# EAGLE design WeMos-Matrix-Shield (EAGLE 7.7.0)
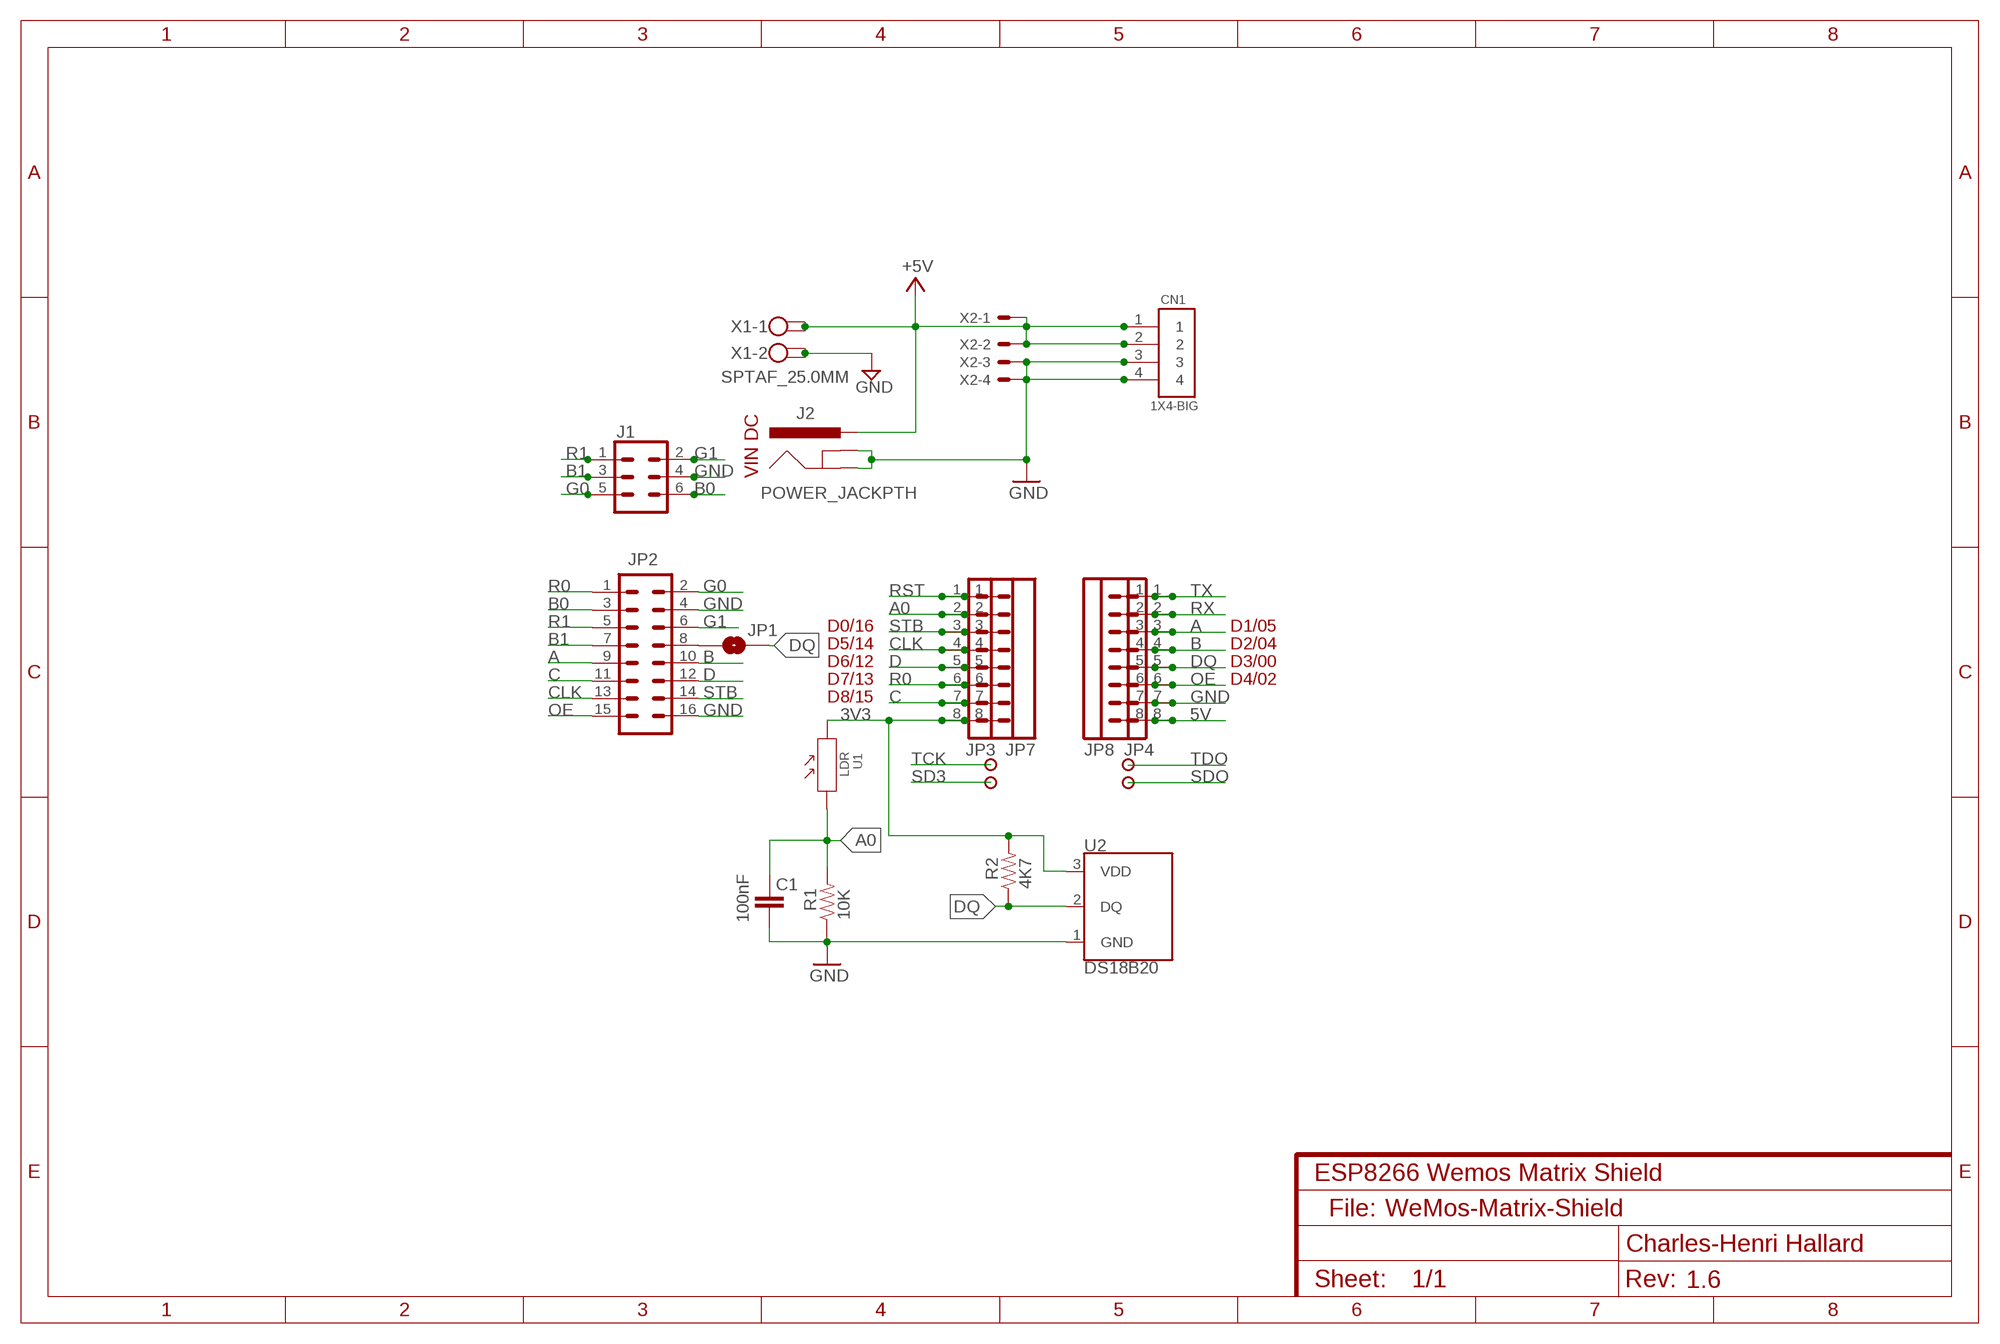
[diagram p0: schematic, sheet 1]
NAME (FRAME-A4L): CNAME: ESP8266 Wemos Matrix Shield; CREVISION: 1.6; DESIGNER: Charles-Henri Hallard

## Parts
C1  100nF  CAPPTH2  [CAP-PTH-SMALL2]
CN1  1X4-BIG  [1X04-BIG]
J1  CONN_03X22X3_SILK_MALE_PTH  [2X3]
J2  POWER_JACKPTH  [POWER_JACK_PTH]
JP1  JUMPER-SMT_2_NO_NO-SILK  [SMT-JUMPER_2_NO_NO-SILK]
JP2  M08X2  [2X8]
JP3  M08NO_SILK_FEMALE_PTH  [1X08_NO_SILK]
JP4  M08NO_SILK_FEMALE_PTH  [1X08_NO_SILK]
JP7  M08NO_SILK_FEMALE_PTH  [1X08_NO_SILK]
JP8  M08NO_SILK_FEMALE_PTH  [1X08_NO_SILK]
R1  10K  RESISTORPTH-1/6W  [1/6W-RES]
R2  4K7  RESISTORPTH-1/6W  [1/6W-RES]
U1  LDR  PHOTORESISTOR-5528-10K(2P-5.0X4.2MM)  [SNR2-3.0]
U2  DS18B20  [TO-92-AMMO]
VIN1  PADNORMAL  [PAD]
VIN2  PADNORMAL  [PAD]
VIN3  PADNORMAL  [PAD]
VIN4  PADNORMAL  [PAD]
X1  SPTAF_25.0MM  [SPTAF_2X50]
X2  KK-156-4  [KK-156-4]

## Nets
3V3: JP3.8 JP7.8 R2.2 U1.2 U2.3(VDD)
5V: CN1.1 CN1.2 J2.PWR JP4.8 JP8.8 X1.1 X1.1A X2.1 X2.2 ; supply symbol labelled +5V
A: JP2.9 JP4.3 JP8.3
A0: C1.1 JP3.2 JP7.2 R1.2 U1.1
B: JP2.10 JP4.4 JP8.4
B0: J1.6 JP2.3
B1: J1.3 JP2.7
C: JP2.11 JP3.7 JP7.7
CLK: JP2.13 JP3.4 JP7.4
D: JP2.12 JP3.5 JP7.5
DQ: JP1.2 JP4.5 JP8.5 R2.1 U2.2(DQ)
G0: J1.5 JP2.2
G1: J1.2 JP2.6
GND: C1.2 CN1.3 CN1.4 J1.4 J2.GND J2.GNDBREAK JP2.4 JP2.16 JP4.7 JP8.7 R1.1 U2.1(GND) X1.2 X1.2A X2.3 X2.4
N$1: JP1.1 JP2.8
OE: JP2.15 JP4.6 JP8.6
R0: JP2.1 JP3.6 JP7.6
R1: J1.1 JP2.5
RST: JP3.1 JP7.1
RX: JP4.2 JP8.2
SD3: VIN4.1
SDO: VIN2.1
STB: JP2.14 JP3.3 JP7.3
TCK: VIN3.1
TDO: VIN1.1
TX: JP4.1 JP8.1

## Notes on the sheet
- VIN DC
- D0/16 | D1/05
- D5/14 | D2/04
- D6/12 | D3/00
- D7/13 | D4/02
- D8/15
- File:

## Library data of the parts
C1 = _c2h:CAP: Capacitor Standard 0603 ceramic capacitor, and 0.1" leaded capacitor.
CN1 = adafruit:1X4: 4-pin connector
J1 = SparkFun-Connectors:CONN_03X2: Multi connection point. Often used as Generic Header-pin footprint for 0.1 inch spaced/style header connections You can populate with any combo of single row headers, but if you'd like an exact match, check these: Header - 2x3 (Male, 0.1") <https://www.sparkfun.com/products/12807> (PRT-12807) Header - 2x3 (Female, 0.1") <https://www.sparkfun.com/products/13010> (PRT-13010) 2x3 Pin Shrouded Header <https://www.sparkfun.com/products/10877> (PRT-10877) On any of the 0.1 inch spaced packages, you can populate with these: Break Away Headers - Straight <https://www.sparkfun.com/products/116> (PRT-00116) Break Away Male Headers - Right Angle <https://www.sparkfun.com/products/553> (PRT-00553) Female Headers <https://www.sparkfun.com/products/115> (PRT-00115) Break Away Headers - Machine Pin <https://www.sparkfun.com/products/117> (PRT-00117) Break Away Female Headers - Swiss Machine Pin <https://www.sparkfun.com/products/743> (PRT-00743) Special note: the shrouded connector mates well with our 3x2 ribbon cables: Ribbon Crimp Connector - 6-pin (2x3, Female) <https://www.sparkfun.com/products/10651> (PRT-10651) Ribbon Cable - 6 wire (15ft) <https://www.sparkfun.com/products/10646> (PRT-10646); PROD_ID: CONN-09701
J2 = SparkFun-Connectors:POWER_JACK: Power Jack This is the standard 5.5mm barrel jack for power. The PTH is the most common, proven, reliable, footprint. The Slot footprint only works if the mill layer is transmitted to the PCB fab house so be warned. Spark Fun Electronics SKU : PRT-00119 SMT: CONN-08106 Mating wall wart : TOL-00298 (and others)
JP1 = SparkFun-Jumpers:JUMPER-SMT_2_NO: Normally open jumper This jumper has two pads in close proximity to each other. Apply solder to close the connection. Round pads are easier to solder for beginners, but are a lot larger. SparkFun Product that uses the round pads: SparkFun EL Sequencer <https://www.sparkfun.com/products/12781>
JP2 = PatternAgents-ProtoPads:M08X2: .1" headers, two rows of 8 each
JP3 JP4 JP7 JP8 = SparkFun-Connectors:M08: Header 8 Standard 8-pin 0.1" header. Use with straight break away headers (SKU : PRT-00116), right angle break away headers (PRT-00553), swiss pins (PRT-00743), machine pins (PRT-00117), and female headers (PRT-00115).; PROD_ID: CONN-08438
R1 R2 = _c2h:RESISTOR: Resistor Basic schematic elements and footprints for 0603, 1206, and PTH resistors.
U1 = Seeed-Sensor:PHOTORESISTOR-5528-10K(2P-5.0X4.2MM): 314020017; MPN: PHOTORESISTOR-5528-10K; VALUE: PHOTORESISTOR-5528-10K
U2 = SparkFun-Sensors:DS18B20: Dallas/Maxim DS18B20 1-Wire Temperature Sensor The DS18B20 reports degrees C with 9 to 12-bit precision, -55C to 125C (+/-0.5C). Each sensor has a unique 64-Bit Serial number etched into it - allows for a huge number of sensors to be used on one data bus. Datasheet <http://datasheets.maximintegrated.com/en/ds/DS18B20.pdf> SparkFun Products One Wire Digital Temperature Sensor - DS18B20 <https://www.sparkfun.com/products/245> (SEN-00245); STORE_ID: SEN-00245
VIN1-VIN4 = _c2h:PAD
X1 = _c2h:SPTAF_2: PHOENIX
X2 = con-molex:KK-156-4: KK 156 HEADER Source: http://www.molex.com/pdm_docs/sd/026604100_sd.pdf; OC_FARNELL: unknown; OC_NEWARK: unknown

## Net classes
0 default: width 0.203 mm, drill 0.356 mm, clearance 0.152 mm
1 power: width 0.203 mm, clearance 0.152 mm

## Board
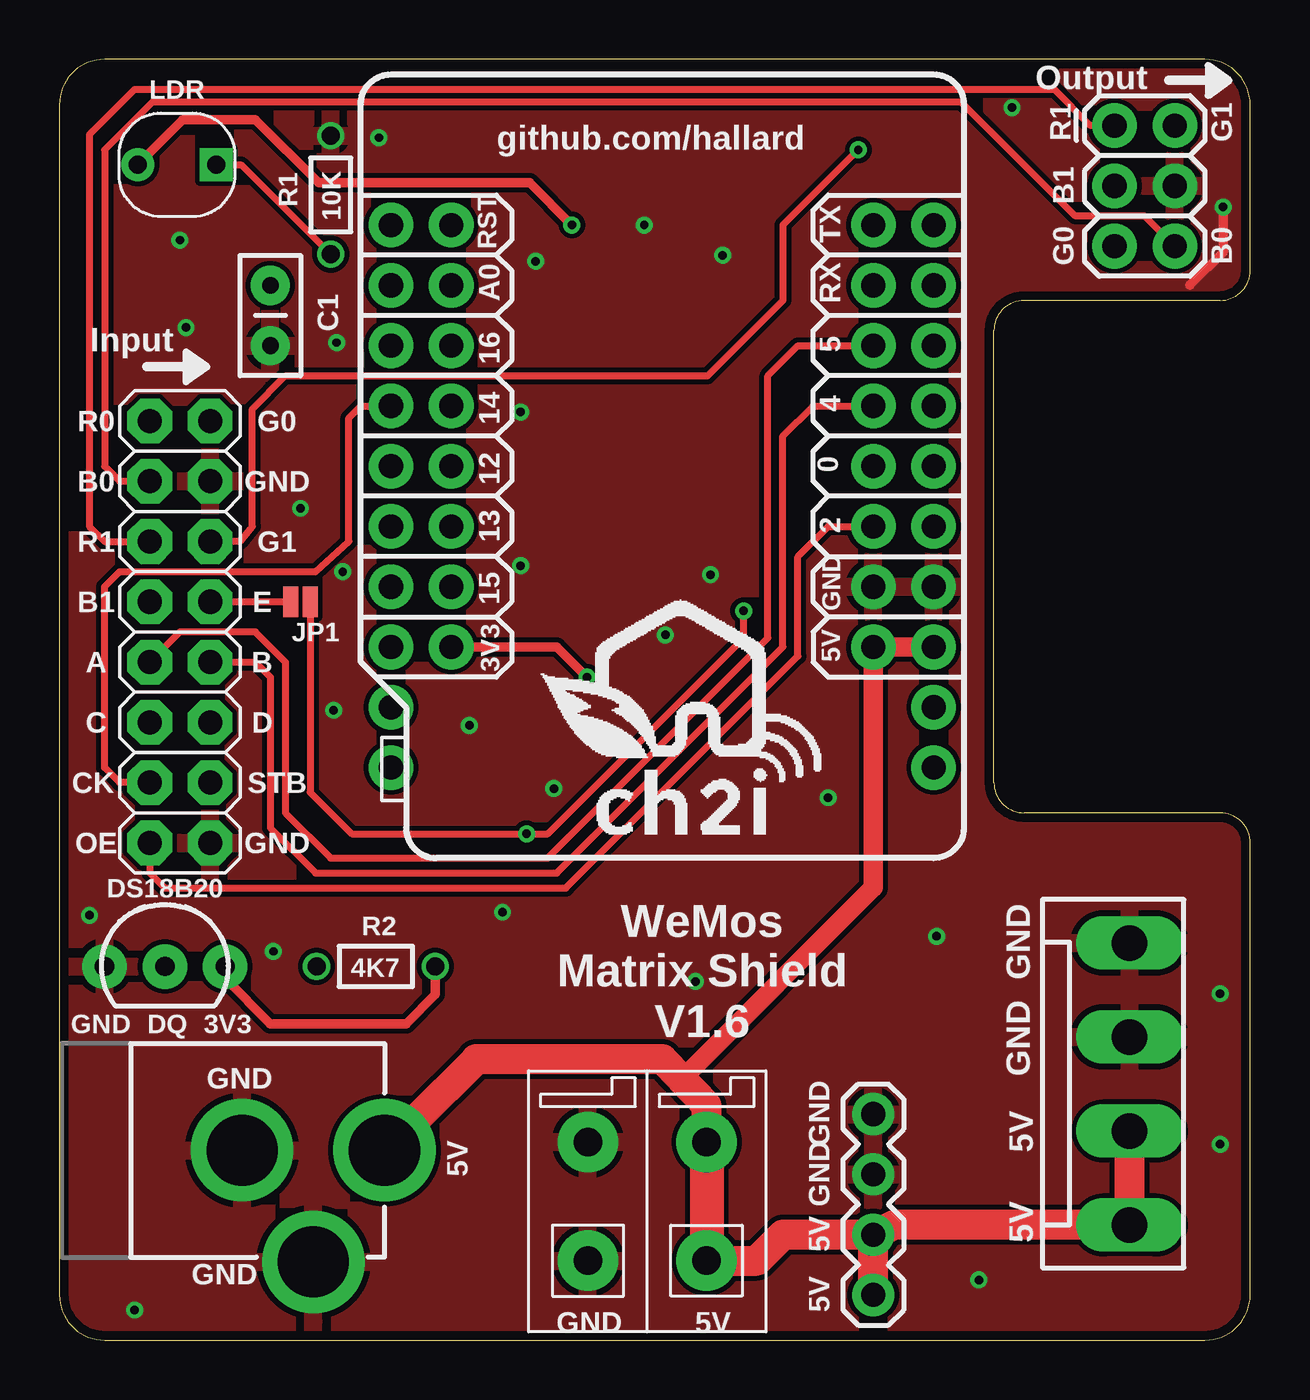
[diagram p1: board, top side]
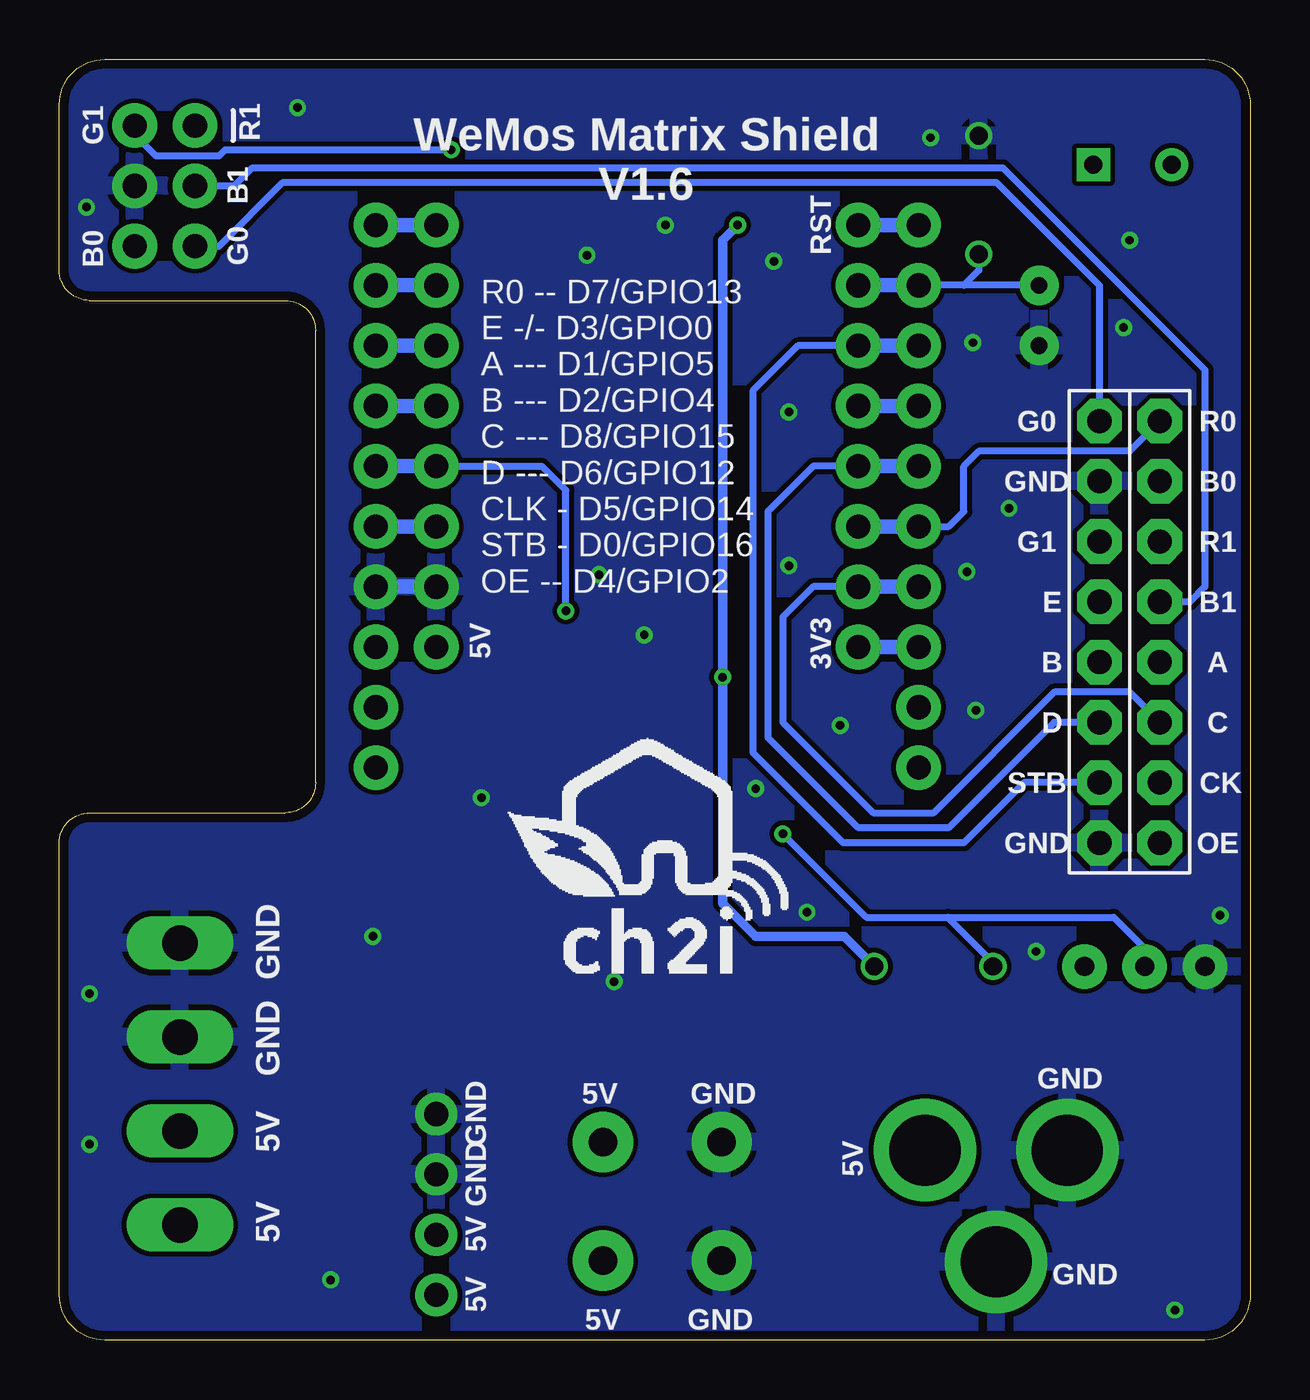
[diagram p2: board, bottom side, seen from below]

Size 50.16 x 53.98 mm. Coordinates in mm from the lower left corner, seen from the top.
Outline: 1.91,53.98 arc90 0,52.07 0,1.91 arc90 1.91,0 48.26,0 arc90 50.16,1.91 50.16,20.95 arc90 48.9,22.23 40.64,22.23 arc-90 39.37,23.5 39.37,42.55 arc-90 40.64,43.81 48.9,43.81 arc90 50.16,45.09 50.16,52.07 arc90 48.26,53.98 1.91,53.98
Copper layers (1*16): Top 0.0356mm / dielectric 1.5011mm / Bottom 0.0356mm
Design rules "PCBs_io *": minimum track width 6mil, minimum drill 13mil, track to track 6mil, track to pad 6mil, pad to pad 6mil, via to via 6mil, smd to smd 6mil, copper to edge 15mil, drill to drill 6mil, minimum pad ring 7mil, minimum via ring 7mil, stop-mask expansion 3mil, vias tented up to drill 40mil, thermal gap 10mil

### Footprints (pad centres in the part's own frame; a part is rotated, then mirrored left to right if it is on the bottom)
CAP-PTH-SMALL2 = drill 0.7 pad 1.651: 1 0,0; 2 2.54,0
1X04-BIG = drill 1.016 pad 1.778: 1 0,0; 2 2.54,0; 3 5.08,0; 4 7.62,0
2X3 = drill 1.016 pad 1.88: 1 0,0; 2 0,2.54; 3 2.54,0; 4 2.54,2.54; 5 5.08,0; 6 5.08,2.54
POWER_JACK_PTH = drill 2.997 pad 4.318: GND 0,7.7; GNDBREAK 4.7,10.7; PWR 0,13.7
SMT-JUMPER_2_NO_NO-SILK = smd 0.635 x 1.27: 1 -0.406,0; 2 0.406,0
2X8 = drill 1.016 pad 1.88 octagon: 1 0,0; 2 0,2.54; 3 2.54,0; 4 2.54,2.54; 5 5.08,0; 6 5.08,2.54; 7 7.62,0; 8 7.62,2.54; 9 10.16,0; 10 10.16,2.54; 11 12.7,0; 12 12.7,2.54; 13 15.24,0; 14 15.24,2.54; 15 17.78,0; 16 17.78,2.54
1X08_NO_SILK = drill 1.016 pad 1.88: 1 0,0; 2 2.54,0; 3 5.08,0; 4 7.62,0; 5 10.16,0; 6 12.7,0; 7 15.24,0; 8 17.78,0
1/6W-RES = drill 0.762: 1 -2.5,0; 2 2.5,0
SNR2-3.0 = drill 0.762 pad 1.397 square: 1 -1.651,0 | drill 0.762 pad 1.397: 2 1.651,0
TO-92-AMMO = drill 0.813 pad 1.88: 1 -2.54,0; 2 0,0; 3 2.54,0
PAD = drill 1.016 pad 1.88: 1 0,0
SPTAF_2X50 = drill 1.2 pad 2.54: 1 -2.5,-2; 1A -2.5,3; 2 2.5,-2; 2A 2.5,3
KK-156-4 = drill 1.5 pad 1.93 long: 1 -5.94,0; 2 -1.98,0; 3 1.98,0; 4 5.94,0

### Placement (x,y rotation side)
C1  8.89,44.45 270 top
CN1  34.29,1.91 90 top
J1  44.45,51.18 270 top
J2  0,8 270 top
JP1  10.16,31.11 0 top
JP2  3.81,38.73 270 top
JP3  13.97,46.99 270 bottom
JP4  36.83,46.99 270 bottom
JP7  16.51,46.99 270 bottom
JP8  34.29,46.99 270 bottom
R1  11.43,48.26 270 top
R2  13.33,15.75 0 top
U1  4.95,49.53 180 top
U2  4.45,15.75 0 top
U$1  [LOGO_CH2I_110MM]  24.77,18.41 0 bottom
U$3  [LOGO_CH2I_110MM]  26.8,24.26 0 top
VIN1  36.83,26.67 0 top
VIN2  36.83,24.13 0 top
VIN3  13.97,26.67 0 top
VIN4  13.97,24.13 0 top
X1  24.77,6.35 180 top
X2  45.09,10.79 90 top

### Tracks (layer width: path | path; a pad name or v marks a point on that pad's centre or on a via)
3V3  (via drill 0.36 pad 0.71)
  Top 0.406: v21.59,46.99 19.81,48.77 10.92,48.77 8.26,51.44 5.21,51.44 U1.2 | U2.3 6.98,15.24 8.89,13.34 14.6,13.34 15.83,14.56 R2.2 | JP7.8 20.95,29.21 v22.23,27.94
  Bottom 0.406: v21.59,46.99 22.23,46.35 v22.23,27.94 22.23,18.41 20.83,17.02 17.1,17.02 R2.2
  Bottom 0.61: JP7.8 JP3.8
5V
  Top 0.813: JP4.8 JP8.8 34.29,19.07 26.21,10.99
  Top 1.016: X1.1A 27.13,3.35
  Top 1.27: J2.PWR 14.97,9.26 17.55,11.84 25.4,11.84 26.21,10.99 27.27,9.89 X1.1 | X2.2 X2.1 35.15,4.86 CN1.2 | CN1.1 CN1.2 | CN1.2 30.48,4.45 29.39,3.35 X1.1A
  Top 1.422: 27.3,8.39 X1.1 X1.1A
A
  Top 0.305: JP8.3 31.12,41.91 29.84,40.64 29.84,29.59 20.57,20.32 11.43,20.32 9.53,22.23 9.53,28.57 8.26,29.84 5.08,29.84 JP2.9
  Bottom 0.61: JP8.3 JP4.3
A0
  Top 0.305: U1.1 7.66,49.53 R1.2
  Bottom 0.305: C1.1 12.06,44.45 | 12.06,44.45 JP3.2 | R1.2 11.43,45.09 12.06,44.45
  Bottom 0.61: JP7.2 JP3.2
B
  Top 0.305: JP8.4 31.75,39.37 30.48,38.1 30.48,29.21 20.95,19.68 10.79,19.68 8.89,21.59 8.89,27.94 8.26,28.57 JP2.10
  Bottom 0.61: JP4.4 JP8.4
B0
  Top 0.305: JP2.3 2.54,36.2 1.91,36.83 1.91,50.16 3.94,52.2 37.97,52.2 42.8,47.37 45.72,47.37 J1.6
B1
  Bottom 0.305: JP2.7 2.54,31.11 1.91,31.75 1.91,40.89 10.41,49.4 42.04,49.4 42.8,48.64 J1.3
C
  Bottom 0.305: JP3.7 18.41,31.75 19.69,30.48 19.69,26.04 15.87,22.23 13.33,22.23 8.26,27.3 5.08,27.3 JP2.11
  Bottom 0.61: JP7.7 JP3.7
CLK
  Top 0.305: JP3.4 12.7,39.37 12.19,38.86 12.19,33.66 10.79,32.38 2.54,32.38 1.91,31.75 1.91,24.13 2.54,23.5 JP2.13
  Bottom 0.61: JP7.4 JP3.4
D
  Bottom 0.305: JP3.5 18.41,36.83 20.32,34.92 20.32,25.4 16.51,21.59 12.7,21.59 8.26,26.04 JP2.12
  Bottom 0.61: JP7.5 JP3.5
DQ  (via drill 0.36 pad 0.71)
  Top 0.305: v28.83,30.73 28.83,29.59 20.57,21.34 v19.69,21.34 12.32,21.34 10.57,23.09 JP1.2
  Bottom 0.305: v28.83,30.73 28.83,35.81 29.84,36.83 JP8.5 | v19.69,21.34 16.17,17.82 12.74,17.82 | 12.74,17.82 10.83,15.91 R2.1 | U2.2 4.45,16.51 5.76,17.82 12.74,17.82
  Bottom 0.61: JP4.5 JP8.5
G0
  Bottom 0.305: JP2.2 6.35,44.45 10.67,48.77 40.77,48.77 43.43,46.1 J1.5
G1  (via drill 0.36 pad 0.71)
  Top 0.305: JP2.6 7.62,33.66 8.13,34.29 8.13,39.24 9.53,40.64 27.3,40.64 30.48,43.81 30.48,46.99 v33.66,50.16
  Bottom 0.305: J1.2 46.99,50.8 46.1,49.91 43.43,49.91 43.18,50.16 v33.66,50.16
GND  (via drill 0.36 pad 0.71)
  Top 0.406: v49.02,47.75 49.02,45.85 47.62,44.45
  Bottom 0.61: JP4.7 JP8.7
  other vias: 27.94,45.72 5.08,46.35 38.73,2.54 3.18,1.27 32.39,22.86 27.43,32.26 24.64,46.99 20.07,45.47 19.43,32.64 19.43,39.12 5.33,42.67 1.27,17.91 11.94,32.38 40.13,51.94 25.53,29.72 10.16,35.05 48.9,8.26 48.9,14.61 17.27,25.91 11.56,26.54 18.67,18.03 20.83,23.24 36.96,17.02 26.8,15.11 9.02,16.38 11.68,42.04 13.46,50.67
  pour Top (isolate 0.203): 51.44,55.24 -1.27,55.24 -1.27,-1.27 51.44,-1.27
  pour Bottom (isolate 0.203): 50.8,-0.64 50.8,54.61 -0.63,54.61 -0.63,-0.64
N$1
  Top 0.305: JP1.1 JP2.8
OE
  Top 0.305: JP8.6 32.39,34.29 31.12,33.02 31.12,28.83 21.34,19.05 4.45,19.05 3.81,19.68 JP2.15
  Bottom 0.61: JP4.6 JP8.6
R0
  Bottom 0.305: JP2.1 5.08,37.47 11.43,37.47 12.06,36.83 12.06,34.92 12.7,34.29 JP3.6
  Bottom 0.61: JP7.6 JP3.6
R1
  Top 0.305: JP2.5 1.91,33.66 1.27,34.29 1.27,50.8 3.18,52.7 41.91,52.7 43.43,51.18 J1.1
RST
  Bottom 0.61: JP7.1 JP3.1
RX
  Bottom 0.61: JP4.2 JP8.2
STB
  Bottom 0.305: JP3.3 19.05,41.91 20.95,40.01 20.95,24.77 17.15,20.95 12.06,20.95 9.53,23.5 JP2.14
  Bottom 0.61: JP7.3 JP3.3
TX
  Bottom 0.61: JP4.1 JP8.1

### Text on the board
tPlace: github.com/hallard
tNames: Output | R1 | G1 | B1 | RST | TX | G0 | B0 | A0 | RX | Input | 5 | 16 | R0 | G0 | 14 | 4 | 0 | B0 | GND | 12 | R1 | G1 | 13 | 2 | B1 | E | 15 | GND | A | B | 5V | 3V3 | C | D | CK | STB | OE | GND | WeMos / Matrix Shield | GND | GND | DQ | 3V3 | V1.6 | GND | GND | GND | 5V | 5V | GND | 5V | 5V | GND | 5V | GND | 5V
bNames: R1 | G1 | WeMos Matrix Shield / V1.6 | B1 | RST | G0 | B0 | R0 | G0 | R0 -- D7/GPIO13 / E -/- D3/GPIO0 / A --- D1/GPIO5 / B --- D2/GPIO4 / C --- D8/GPIO15 / D --- D6/GPIO12 / CLK - D5/GPIO14 / STB - D0/GPIO16 / OE -- D4/GPIO2 | B0 | GND | R1 | G1 | B1 | E | 3V3 | 5V | A | B | C | D | CK | STB | OE | GND | GND | GND | GND | GND | 5V | GND | 5V | 5V | GND | 5V | 5V | GND | 5V | GND | 5V